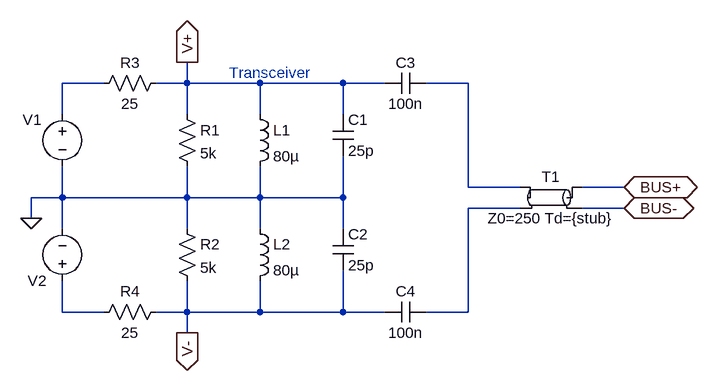
[diagram p0: schematic Transceiver.asc]
Transceiver.asc, the LTspice schematic file:
Version 4
SHEET 1 1484 848
WIRE -320 16 -384 16
WIRE -192 16 -192 -16
WIRE -192 16 -240 16
WIRE -80 16 -192 16
WIRE 48 16 -80 16
WIRE 112 16 48 16
WIRE 240 16 176 16
WIRE -384 64 -384 16
WIRE -192 64 -192 16
WIRE -80 64 -80 16
WIRE 48 64 48 16
WIRE 240 176 240 16
WIRE 320 176 240 176
WIRE 480 176 416 176
WIRE -384 192 -384 144
WIRE -384 192 -432 192
WIRE -192 192 -192 144
WIRE -192 192 -384 192
WIRE -80 192 -80 144
WIRE -80 192 -192 192
WIRE 48 192 48 128
WIRE 48 192 -80 192
WIRE 320 208 240 208
WIRE 480 208 416 208
WIRE -432 224 -432 192
WIRE -384 240 -384 192
WIRE -192 240 -192 192
WIRE -80 240 -80 192
WIRE 48 240 48 192
WIRE -384 368 -384 320
WIRE -320 368 -384 368
WIRE -192 368 -192 320
WIRE -192 368 -240 368
WIRE -80 368 -80 320
WIRE -80 368 -192 368
WIRE 48 368 48 304
WIRE 48 368 -80 368
WIRE 112 368 48 368
WIRE 240 368 240 208
WIRE 240 368 176 368
WIRE -192 400 -192 368
FLAG -432 224 0
FLAG -192 -16 V+
IOPIN -192 -16 Out
FLAG -192 400 V-
IOPIN -192 400 Out
FLAG 480 208 BUS-
IOPIN 480 208 BiDir
FLAG 480 176 BUS+
IOPIN 480 176 BiDir
SYMBOL res -224 0 R90
WINDOW 0 0 56 VBottom 2
WINDOW 3 32 56 VTop 2
SYMATTR InstName R3
SYMATTR Value 25
SYMBOL res -224 352 R90
WINDOW 0 0 56 VBottom 2
WINDOW 3 32 56 VTop 2
SYMATTR InstName R4
SYMATTR Value 25
SYMBOL voltage -384 336 R180
WINDOW 123 0 0 Left 2
WINDOW 39 0 0 Left 2
WINDOW 3 -297 -35 Invisible 2
SYMATTR Value PWL file=negDME.dat
SYMATTR InstName V2
SYMBOL voltage -384 48 R0
WINDOW 123 0 0 Left 2
WINDOW 39 0 0 Left 2
WINDOW 0 -61 24 Left 2
WINDOW 3 -212 -28 Invisible 2
SYMATTR InstName V1
SYMATTR Value PWL file=posDME.dat
SYMBOL res -208 48 R0
SYMATTR InstName R1
SYMATTR Value 5k
SYMBOL res -208 224 R0
SYMATTR InstName R2
SYMATTR Value 5k
SYMBOL cap 32 64 R0
SYMATTR InstName C1
SYMATTR Value 25p
SYMBOL cap 32 240 R0
SYMATTR InstName C2
SYMATTR Value 25p
SYMBOL cap 112 0 M90
WINDOW 0 0 32 VBottom 2
WINDOW 3 32 32 VTop 2
SYMATTR InstName C3
SYMATTR Value 100n
SYMBOL cap 112 352 M90
WINDOW 0 0 32 VBottom 2
WINDOW 3 32 32 VTop 2
SYMATTR InstName C4
SYMATTR Value 100n
SYMBOL tline 368 192 M0
SYMATTR InstName T1
SYMATTR Value Z0=250 Td={stub}
SYMBOL ind -96 48 R0
SYMATTR InstName L1
SYMATTR Value 80µ
SYMBOL ind -96 224 R0
SYMATTR InstName L2
SYMATTR Value 80µ
TEXT -64 0 Center 2 ;Transceiver

The netlist it stands for:
* Transceiver.asc
R3 V+ N001 25
R4 V- N004 25
V2 N004 0 PWL file=negDME.dat
V1 N001 0 PWL file=posDME.dat
R1 V+ 0 5k
R2 0 V- 5k
C1 V+ 0 25p
C2 0 V- 25p
C3 V+ N002 100n
C4 V- N003 100n
T1 BUS+ BUS- N002 N003 Z0=250 Td={stub}
L1 V+ 0 80µ
L2 0 V- 80µ
* Transceiver
.backanno
.end